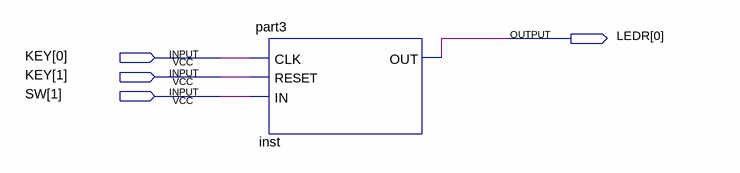
[diagram p0: schematic sheet]
// Quartus schematic Block3.bdf as structural Verilog: 1 symbols, 4 pins
module Block3 (
  input  [1:0] KEY,
  input  [1:1] SW,
  output [0:0] LEDR
);

  part3 inst (.CLK(KEY[0]), .RESET(KEY[1]), .IN(SW[1]), .OUT(LEDR[0]));
endmodule
